# EAGLE design side_small (EAGLE 9.3.0)
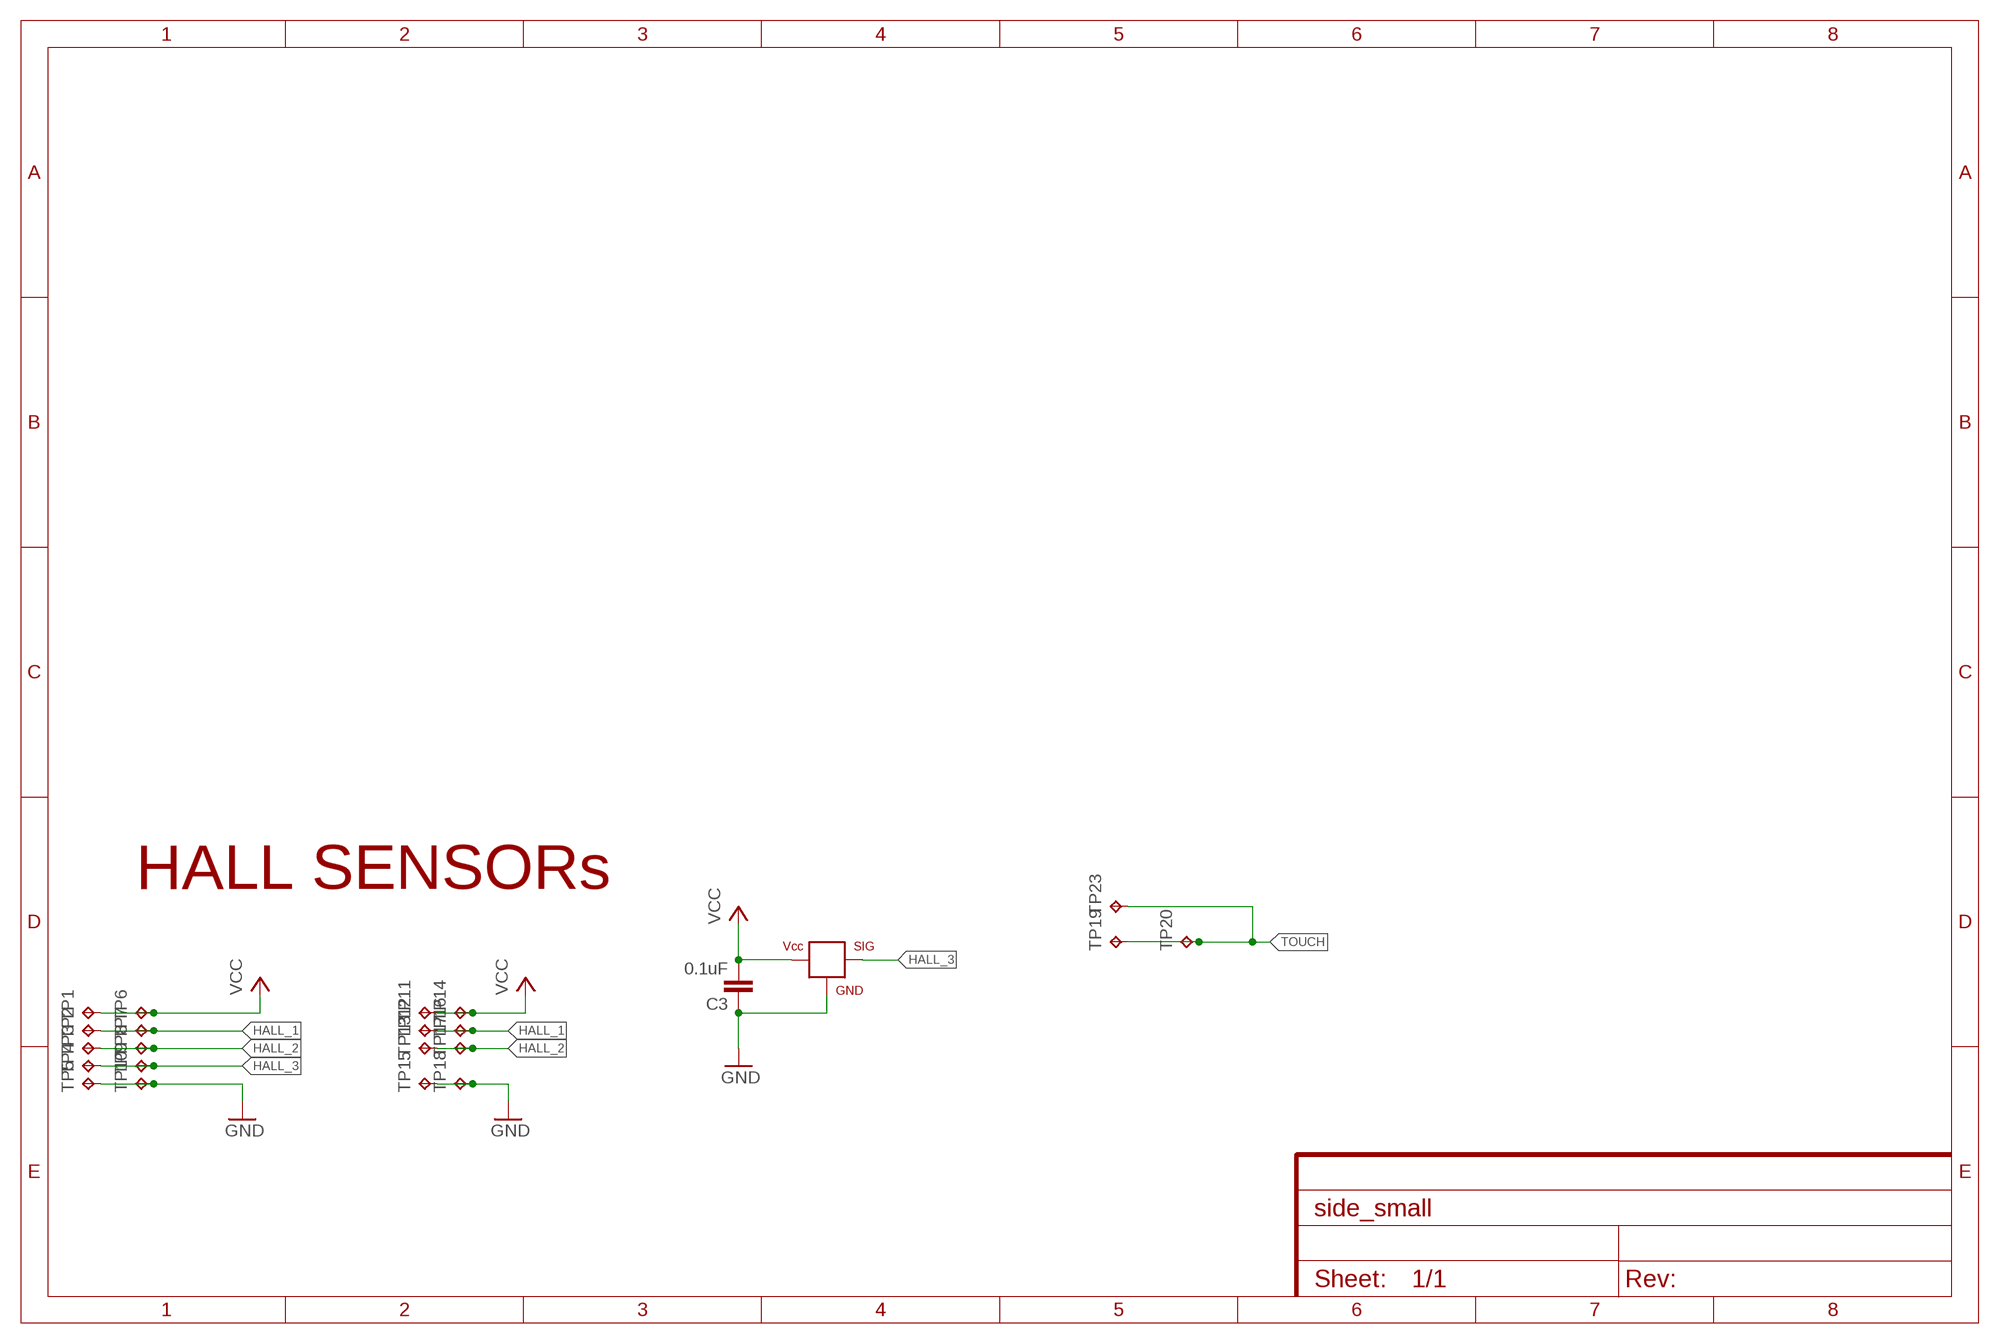
[diagram p0: schematic, sheet 1]

## Parts
C3  0.1uF  CAP0603-CAP  [0603-CAP]
HALL  HALLEFFECT-A1326  [SOT23-3]
TP1  TPTP10SQ  [TP10SQ]
TP2  TPTP10SQ  [TP10SQ]
TP3  TPTP10SQ  [TP10SQ]
TP4  TPTP10SQ  [TP10SQ]
TP5  TPTP10SQ  [TP10SQ]
TP6  TPTP10SQ  [TP10SQ]
TP7  TPTP10SQ  [TP10SQ]
TP8  TPTP10SQ  [TP10SQ]
TP9  TPTP10SQ  [TP10SQ]
TP10  TPTP10SQ  [TP10SQ]
TP11  TPTP10SQ  [TP10SQ]
TP12  TPTP10SQ  [TP10SQ]
TP13  TPTP10SQ  [TP10SQ]
TP14  TPTP10SQ  [TP10SQ]
TP15  TPTP10SQ  [TP10SQ]
TP16  TPTP10SQ  [TP10SQ]
TP17  TPTP10SQ  [TP10SQ]
TP18  TPTP10SQ  [TP10SQ]
TP19  TPTP10SQ  [TP10SQ]
TP20  TPTP10SQ  [TP10SQ]
TP23  TPTP10SQ  [TP10SQ]

## Nets
GND: C3.1 HALL.3(GND) TP5.TP TP10.TP TP15.TP TP18.TP
HALL_1: TP2.TP TP7.TP TP12.TP TP16.TP
HALL_2: TP3.TP TP8.TP TP13.TP TP17.TP
HALL_3: HALL.2(SIG) TP4.TP TP9.TP
TOUCH: TP19.TP TP20.TP TP23.TP
VCC: C3.2 HALL.1(VCC) TP1.TP TP6.TP TP11.TP TP14.TP

## Notes on the sheet
- HALL SENSORs

## Library data of the parts
C3 = SparkFun:CAP: Capacitor Standard 0603 ceramic capacitor, and 0.1" leaded capacitor.
HALL = Andy_Sigler:HALLEFFECT-A1326
TP1-TP20 TP23 = testpad:TP: Test pad

## Board
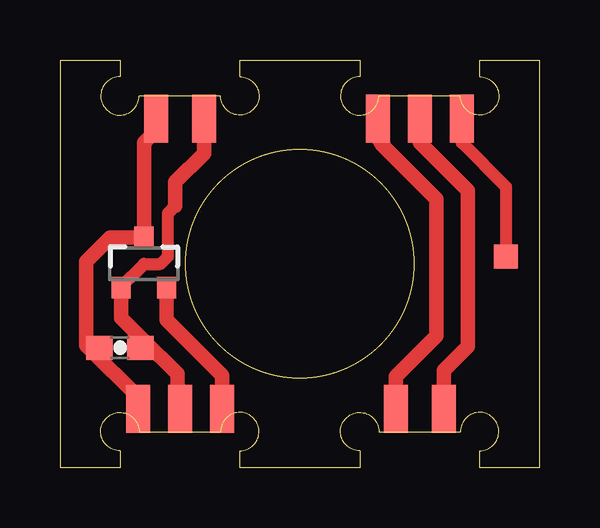
[diagram p1: board, top side]

Size 20 x 17 mm. Coordinates in mm from the lower left corner, seen from the top.
Outline: 20,0 20,17 17.5,17 17.5,16.3 arc-270 16.7,15.5 13.3,15.5 arc-270 12.5,16.3 12.5,17 7.5,17 7.5,16.3 arc-270 6.7,15.5 3.3,15.5 arc-270 2.5,16.3 2.5,17 0,17 0,0 2.5,0 2.5,0.7 arc-270 3.3,1.5 6.7,1.5 arc-270 7.5,0.7 7.5,0 12.5,0 12.5,0.7 arc-270 13.3,1.5 16.7,1.5 arc-270 17.5,0.7 17.5,0 20,0
Outline: circle at 10,8.5 radius 4.76
Copper layers (1*16): Top 0.0356mm / dielectric 1.5011mm / Bottom 0.0356mm
Design rules "LaenPCBOrder *": minimum track width 6mil, minimum drill 13mil, track to track 6mil, track to pad 6mil, pad to pad 6mil, via to via 6mil, smd to smd 6mil, copper to edge 15mil, drill to drill 6mil, minimum pad ring 7mil, minimum via ring 7mil, stop-mask expansion 3mil, vias tented up to drill 20mil, thermal gap 10mil

### Footprints (pad centres in the part's own frame; a part is rotated, then mirrored left to right if it is on the bottom)
0603-CAP = smd 1.1 x 1: 1 -0.85,0; 2 0.85,0
SOT23-3 = smd 0.8 x 0.9: 1 -0.95,-1; 2 0.95,-1; 3 0,1.1
TP10SQ = smd 1 x 1: TP 0,0

### Placement (x,y rotation side)
C3  2.5,5 0 top
HALL  3.5,8.5 0 top
TP1  5,1.95 270 top
TP2  15,14.05 270 top
TP3  13.25,14.05 270 top
TP4  6.75,1.95 270 top
TP5  3.25,1.95 270 top
TP6  6,14.05 270 top
TP7  15,15.05 270 top
TP8  13.25,15.05 270 top
TP9  6.75,2.95 270 top
TP10  4,14.05 270 top
TP11  6,15.05 270 top
TP12  16,1.95 270 top
TP13  14,1.95 270 top
TP14  5,2.95 270 top
TP15  4,15.05 270 top
TP16  16,2.95 270 top
TP17  14,2.95 270 top
TP18  3.25,2.95 270 top
TP19  18.6,8.8 0 top
TP20  16.75,14.05 0 top
TP23  16.75,15.05 0 top

### Tracks (layer width: path | path; a pad name or v marks a point on that pad's centre or on a via)
GND
  Top 0.61: TP15.TP TP10.TP 3.5,13.55 HALL.3 2.1,9.6 1.1,8.6 1.1,5.1 1.2,5 | TP5.TP TP18.TP 1.2,5 | C3.1 1.2,5
HALL_1
  Top 0.61: TP7.TP TP2.TP 15,13.55 17,11.55 17,5.05 16,4.05 TP16.TP TP12.TP
HALL_2
  Top 0.61: TP8.TP TP3.TP 13.25,13.73 13.4,13.5 15.7,11.2 15.7,5.5 14,3.8 TP17.TP TP13.TP
HALL_3
  Top 0.61: TP4.TP TP9.TP 6.75,3.85 4.45,6.15 HALL.2
TOUCH
  Top 0.508: 18.4,8.6 TP19.TP 18.6,11.7 16.75,13.55 TP20.TP TP23.TP
VCC
  Top 0.508: HALL.1 2.55,7.55 3.5,8.5 4.2,8.5 4.5,8.8 4.5,10.6 4.8,10.9
  Top 0.61: TP11.TP TP6.TP 6,13.1 4.8,11.9 4.8,10.9 | TP1.TP TP14.TP 4.9,3.05 4.9,3.9 3.45,5.35 | 3.45,5.35 2.55,6.25 HALL.1 | C3.2 3.45,5.1 3.45,5.35